# Altium schematic sheet USB_WIFI_PING.SchDoc
size B; DocumentNumber: 1; SheetNumber: 1; SheetTotal: 1
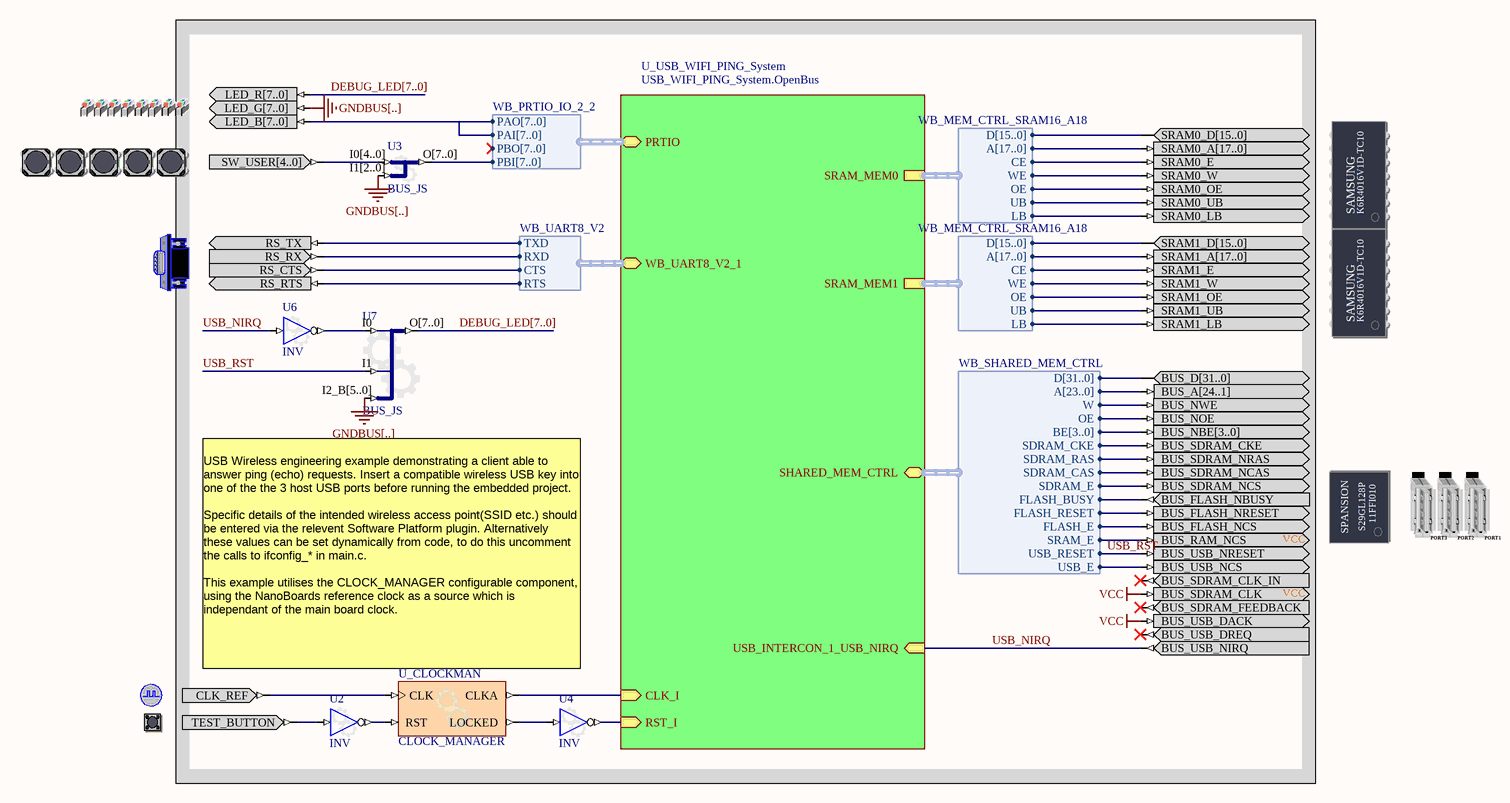
[diagram p0: USB_WIFI_PING.SchDoc]

## Parts
(Parts that share a designator on the sheet are numbered #1, #2 ... from top to bottom, then left to right.)
?#1  LEDS_RGB  (value not drawn)
?#2  SRAM_DAUGHTER0  (value not drawn)
?#3  USER_BUTTONS  (value not drawn)
?#4  SRAM_DAUGHTER1  (value not drawn)
?#5  RS232CNTR  (value not drawn)
?#6  SHARED_FLASH_USB  (value not drawn)
?#7  CLOCK_REFERENCE  (value not drawn)
?#8  TEST_BUTTON  (value not drawn)
U2  INV
U3  BUS_JS
U4  INV
U6  INV
U7  BUS_JS
U_CLOCKMAN  CLOCK_MANAGER

## Sub-sheets
U_USB_WIFI_PING_System = USB_WIFI_PING_System.OpenBus: SRAM_MEM0 (harness WB_MEM_CTRL_SRAM16_A18), SRAM_MEM1 (harness WB_MEM_CTRL_SRAM16_A18), RST_I (in), CLK_I (in), PRTIO (harness WB_PRTIO_IO_2_2), SHARED_MEM_CTRL (harness WB_SHARED_MEM_CTRL), USB_INTERCON_1_USB_NIRQ (in), WB_UART8_V2_1 (harness WB_UART8_V2)

## Harnesses
WB_PRTIO_IO_2_2: PAO[7..0], PAI[7..0], PBO[7..0], PBI[7..0]
WB_MEM_CTRL_SRAM16_A18: D[15..0], A[17..0], CE, WE, OE, UB, LB
WB_SHARED_MEM_CTRL: D[31..0], A[23..0], W, OE, BE[3..0], SDRAM_CKE, SDRAM_RAS, SDRAM_CAS, SDRAM_E, FLASH_BUSY, FLASH_RESET, FLASH_E, SRAM_E, USB_RESET, USB_E
WB_UART8_V2: TXD, RXD, CTS, RTS

## Nets
GNDBUS[..]: ?#1.LED_G[7..0] U3.I1[2..0] U7.I2_B[5..0]
VCC: ?#6.BUS_SDRAM_CLK ?#6.BUS_USB_DACK
DEBUG_LED[7..0]: ?#1.LED_R[7..0] U7.O[7..0]
USB_NIRQ: ?#6.BUS_USB_NIRQ U6.I ; sheet U_USB_WIFI_PING_System/USB_INTERCON_1_USB_NIRQ
USB_RST: ?#6.BUS_USB_NRESET U7.I1 ; sheet U_USB_WIFI_PING_System/SHARED_MEM_CTRL.USB_RESET
Net?#1_LED_B[7..0]: ?#1.LED_B[7..0] ; sheet U_USB_WIFI_PING_System/PRTIO.PAO[7..0], sheet U_USB_WIFI_PING_System/PRTIO.PAI[7..0]
Net?#2_SRAM0_A[17..0]: ?#2.SRAM0_A[17..0] ; sheet U_USB_WIFI_PING_System/SRAM_MEM0.A[17..0]
Net?#2_SRAM0_D[15..0]: ?#2.SRAM0_D[15..0] ; sheet U_USB_WIFI_PING_System/SRAM_MEM0.D[15..0]
Net?#2_SRAM0_E: ?#2.SRAM0_E ; sheet U_USB_WIFI_PING_System/SRAM_MEM0.CE
Net?#2_SRAM0_LB: ?#2.SRAM0_LB ; sheet U_USB_WIFI_PING_System/SRAM_MEM0.LB
Net?#2_SRAM0_OE: ?#2.SRAM0_OE ; sheet U_USB_WIFI_PING_System/SRAM_MEM0.OE
Net?#2_SRAM0_UB: ?#2.SRAM0_UB ; sheet U_USB_WIFI_PING_System/SRAM_MEM0.UB
Net?#2_SRAM0_W: ?#2.SRAM0_W ; sheet U_USB_WIFI_PING_System/SRAM_MEM0.WE
Net?#3_SW_USER[4..0]: ?#3.SW_USER[4..0] U3.I0[4..0]
Net?#4_SRAM1_A[17..0]: ?#4.SRAM1_A[17..0] ; sheet U_USB_WIFI_PING_System/SRAM_MEM1.A[17..0]
Net?#4_SRAM1_D[15..0]: ?#4.SRAM1_D[15..0] ; sheet U_USB_WIFI_PING_System/SRAM_MEM1.D[15..0]
Net?#4_SRAM1_E: ?#4.SRAM1_E ; sheet U_USB_WIFI_PING_System/SRAM_MEM1.CE
Net?#4_SRAM1_LB: ?#4.SRAM1_LB ; sheet U_USB_WIFI_PING_System/SRAM_MEM1.LB
Net?#4_SRAM1_OE: ?#4.SRAM1_OE ; sheet U_USB_WIFI_PING_System/SRAM_MEM1.OE
Net?#4_SRAM1_UB: ?#4.SRAM1_UB ; sheet U_USB_WIFI_PING_System/SRAM_MEM1.UB
Net?#4_SRAM1_W: ?#4.SRAM1_W ; sheet U_USB_WIFI_PING_System/SRAM_MEM1.WE
Net?#5_RS_CTS: ?#5.RS_CTS ; sheet U_USB_WIFI_PING_System/WB_UART8_V2_1.CTS
Net?#5_RS_RTS: ?#5.RS_RTS ; sheet U_USB_WIFI_PING_System/WB_UART8_V2_1.RTS
Net?#5_RS_RX: ?#5.RS_RX ; sheet U_USB_WIFI_PING_System/WB_UART8_V2_1.RXD
Net?#5_RS_TX: ?#5.RS_TX ; sheet U_USB_WIFI_PING_System/WB_UART8_V2_1.TXD
Net?#6_BUS_A[24..1]: ?#6.BUS_A[24..1] ; sheet U_USB_WIFI_PING_System/SHARED_MEM_CTRL.A[23..0]
Net?#6_BUS_D[31..0]: ?#6.BUS_D[31..0] ; sheet U_USB_WIFI_PING_System/SHARED_MEM_CTRL.D[31..0]
Net?#6_BUS_FLASH_NBUSY: ?#6.BUS_FLASH_NBUSY ; sheet U_USB_WIFI_PING_System/SHARED_MEM_CTRL.FLASH_BUSY
Net?#6_BUS_FLASH_NCS: ?#6.BUS_FLASH_NCS ; sheet U_USB_WIFI_PING_System/SHARED_MEM_CTRL.FLASH_E
Net?#6_BUS_FLASH_NRESET: ?#6.BUS_FLASH_NRESET ; sheet U_USB_WIFI_PING_System/SHARED_MEM_CTRL.FLASH_RESET
Net?#6_BUS_NBE[3..0]: ?#6.BUS_NBE[3..0] ; sheet U_USB_WIFI_PING_System/SHARED_MEM_CTRL.BE[3..0]
Net?#6_BUS_NOE: ?#6.BUS_NOE ; sheet U_USB_WIFI_PING_System/SHARED_MEM_CTRL.OE
Net?#6_BUS_NWE: ?#6.BUS_NWE ; sheet U_USB_WIFI_PING_System/SHARED_MEM_CTRL.W
Net?#6_BUS_RAM_NCS: ?#6.BUS_RAM_NCS ; sheet U_USB_WIFI_PING_System/SHARED_MEM_CTRL.SRAM_E
Net?#6_BUS_SDRAM_CKE: ?#6.BUS_SDRAM_CKE ; sheet U_USB_WIFI_PING_System/SHARED_MEM_CTRL.SDRAM_CKE
Net?#6_BUS_SDRAM_NCAS: ?#6.BUS_SDRAM_NCAS ; sheet U_USB_WIFI_PING_System/SHARED_MEM_CTRL.SDRAM_CAS
Net?#6_BUS_SDRAM_NCS: ?#6.BUS_SDRAM_NCS ; sheet U_USB_WIFI_PING_System/SHARED_MEM_CTRL.SDRAM_E
Net?#6_BUS_SDRAM_NRAS: ?#6.BUS_SDRAM_NRAS ; sheet U_USB_WIFI_PING_System/SHARED_MEM_CTRL.SDRAM_RAS
Net?#6_BUS_USB_NCS: ?#6.BUS_USB_NCS ; sheet U_USB_WIFI_PING_System/SHARED_MEM_CTRL.USB_E
Net?#7_CLK_REF: ?#7.CLK_REF U_CLOCKMAN.CLK
Net?#8_TEST_BUTTON: ?#8.TEST_BUTTON U2.I
NetU2_O: U2.O U_CLOCKMAN.RST
NetU3_O[7..0]: U3.O[7..0] ; sheet U_USB_WIFI_PING_System/PRTIO.PBI[7..0]
NetU4_I: U4.I U_CLOCKMAN.LOCKED
NetU4_O: U4.O ; sheet U_USB_WIFI_PING_System/RST_I
NetU6_O: U6.O U7.I0
NetU_CLOCKMAN_CLKA: U_CLOCKMAN.CLKA ; sheet U_USB_WIFI_PING_System/CLK_I

Not connected (* = marked no-connect by the designer): ?#6 BUS_SDRAM_CLK_IN* BUS_SDRAM_FEEDBACK* BUS_USB_DREQ*

## Buses and harness runs
bus DEBUG_LED[7..0]

## Notes on the sheet
- USB Wireless engineering example demonstrating a client able to answer ping (echo) requests. Insert a compatible wireless USB key into one of the the 3 host USB ports before running the embedded project.
  Specific details of the intended wireless access point(SSID etc.) should be entered via the relevent Software Platform plugin. Alternatively these values can be set dynamically from code, to do this uncomment the calls to ifconfig_* in main.c.
  This example utilises the CLOCK_MANAGER configurable component, using the NanoBoards reference clock as a source which is independant of the main board clock.
- Title
- Size:
- Date:
- B
- Number:
- Time:
- Revision:
- Sheet
- of
- File:
- (in symbol SHARED_FLASH_USB) USB2; 11FFI010; SPANSION; S29GL128P; PORT3; PORT2; PORT1; VCC
- (in symbol SRAM_DAUGHTER0) SAMSUNG; K6R4016V1D-TC10
- (in symbol SRAM_DAUGHTER1) SAMSUNG; K6R4016V1D-TC10

## Library data of the parts
?#1 = LEDS_RGB: LEDS RGB; PortComponent: True; Published: 11-Mar-2009; Publisher: Altium Limited; HelpURL: https://wiki.altium.com/display/ADOH/NanoBoard+3000+-+RGB+User+LEDs
?#2 = SRAM_DAUGHTER0: Free Static RAM - Daughterboard; PortComponent: True; Published: 14-May-2007; Publisher: Altium Limited; HelpURL: TR0149 Technical Reference for Altium's Xilinx Spartan-3 Daughter Board DB30.pdf#page=16
?#3 = USER_BUTTONS: Generic User Buttons; PortComponent: True; Published: 16-Apr-2007; Publisher: Altium Limited; HelpURL: TR0143 Technical Reference Manual for Altium's Desktop NanoBoard NB2DSK01.pdf#page=53
?#4 = SRAM_DAUGHTER1: Free Static RAM - Daughterboard; PortComponent: True; Published: 14-May-2007; Publisher: Altium Limited; HelpURL: TR0149 Technical Reference for Altium's Xilinx Spartan-3 Daughter Board DB30.pdf#page=16
?#5 = RS232CNTR: DCE Serial Port Connector; PortComponent: True; Published: 19-Nov-2003; Publisher: Altium Limited; HelpURL: https://wiki.altium.com/display/ADOH/NanoBoard+3000+-+RS-232+Serial+Interface
?#6 = SHARED_FLASH_USB: Common-Bus Flash USB; PortComponent: True; Published: 14-May-2007; Publisher: Altium Limited; HelpURL: TR0149 Technical Reference for Altium's Xilinx Spartan-3 Daughter Board DB30.pdf#page=14
?#7 = CLOCK_REFERENCE: Global System Clock Reference Supply; PortComponent: True; Published: 19-Nov-2003; Publisher: Altium Limited; HelpURL: https://wiki.altium.com/display/ADOH/NanoBoard+3000+-+System+Clocks
?#8 = TEST_BUTTON: Test / Reset Button; PortComponent: True; Published: 19-Nov-2003; Publisher: Altium Limited; HelpURL: TR0143 Technical Reference Manual for Altium's Desktop NanoBoard NB2DSK01.pdf#page=53
U2 U4 = INV: Configurable Inverter; ConfigurationParameters: {}Version[1.1]{}SignalCount[1]{}SignalWidth0[1]{}OutputOption0[Inverted]{}EnableMode[None]{}ShowPinNames[False]{}; ConfiguratorName: GENERIC_BUFFER; LastRevisionNo: 1.00.00; Published: 10-Oct-2008; Publisher: Altium Limited; HelpURL: https://wiki.altium.com/display/ADOH/Configurable+Generic+Library
U3 = BUS_JS: Configurable Bus Joiner/Splitter; ConfiguratorName: GENERIC_BUS_JS; ConfigurationParameters: {}Version[1.0]{}SplitterJoinerType[Joiner]{}SignalCount[2]{}SignalWidth0[5]{}SignalWidth1[3]{}; LastRevisionNo: 1.00.00; Published: 17-Sep-2008; Publisher: Altium Limited
U6 = INV: Configurable Inverter; ConfiguratorName: GENERIC_BUFFER; ConfigurationParameters: {}Version[1.1]{}SignalCount[1]{}SignalWidth0[1]{}OutputOption0[Inverted]{}EnableMode[None]{}ShowPinNames[False]{}; LastRevisionNo: 1.00.00; Published: 19-Sep-2008; Publisher: Altium Limited; HelpURL: https://wiki.altium.com/display/ADOH/Configurable+Generic+Library
U7 = BUS_JS: Configurable Bus Joiner/Splitter; ConfiguratorName: GENERIC_BUS_JS; ConfigurationParameters: {}Version[1.1]{}SplitterJoinerType[Joiner]{}SignalCount[3]{}SignalWidth0[1]{}GapBelow0[3000000]{}ConnectionType0[Pin]{}SignalWidth1[1]{}GapBelow1[2000000]{}ConnectionType1[Pin]{}SignalWidth2[6]{}GapBelow2[2000000]{}ConnectionType2[Pin]{}ShowPinNames[True]{}; LastRevisionNo: 1.00.00; Published: 17-Sep-2008; Publisher: Altium Limited; HelpURL: https://wiki.altium.com/display/ADOH/Configurable+Generic+Library
U_CLOCKMAN = CLOCKMANAGER: Configurable Clock Manager; ConfiguratorName: GENERIC_CLOCKMANAGER; ConfigurationParameters: {}Version[1.0]{}Option_Configuration[object TClockManagerPersist / VersionMajor [ 0 / VersionMinor [ 0 / InputFreq [ 20.000000000000000000 / InputName [ 'CLK' / OutputTargets [ < / item / Name [ 'CLKA' / OutFreqMin [ 40.000000000000000000 / OutFreqMax [ 40.000000000000000000 / OutPostDivider [ 1.000000000000000000 / end> / OutputDevices [ < / item / Name [ 'Spartan3AN' / Valid [ True / OutputActuals [ < / item / Name [ 'CLK0' / Multipler [ 1.000000000000000000 / Divider [ 1.000000000000000000 / OutFreq [ 20.000000000000000000 / OutputMap [ 1 / end / item / Name [ 'CLK90' / Multipler [ 1.000000000000000000 / Divider [ 1.000000000000000000 / OutPhase [ 90.000000000000000000 / OutFreq [ 20.000000000000000000 / OutputMap [ 2 / end / item / Name [ 'CLK180' / Multipler [ 1.000000000000000000 / Divider [ 1.000000000000000000 / OutPhase [ 180.000000000000000000 / OutFreq [ 20.000000000000000000 / OutputMap [ 3 / end / item / Name [ 'CLK270' / Multipler [ 1.000000000000000000 / Divider [ 1.000000000000000000 / OutPhase [ 270.000000000000000000 / OutFreq [ 20.000000000000000000 / OutputMap [ 4 / end / item / Name [ 'CLK2X' / Multipler [ 2.000000000000000000 / Divider [ 1.000000000000000000 / OutFreq [ 40.000000000000000000 / OutputMap [ 0 / end / item / Name [ 'CLKDV' / Multipler [ 1.000000000000000000 / Divider [ 2.000000000000000000 / OutFreq [ 10.000000000000000000 / OutputMap [ 5 / end / item / Name [ 'CLK2X180' / Multipler [ 1.000000000000000000 / Divider [ 1.000000000000000000 / OutPhase [ 180.000000000000000000 / OutFreq [ 40.000000000000000000 / OutputMap [ 6 / end / item / Name [ 'CLKFX' / Multipler [ 2.000000000000000000 / Divider [ 1.000000000000000000 / OutFreq [ 40.000000000000000000 / OutputMap [ 7 / end / item / Name [ 'CLKFX180' / Multipler [ 1.000000000000000000 / Divider [ 1.000000000000000000 / OutPhase [ 180.000000000000000000 / OutFreq [ 40.000000000000000000 / OutputMap [ 8 / end> / InternalActuals [ <> / CustomVars [ <> / end> / MinInputFreq [ 1.000000000000000000 / MaxInputFreq [ 280.000000000000000000 / MinOutputFreq [ 18.000000000000000000 / MaxOutputFreq [ 210.000000000000000000 / MaxOutputCount [ 9 / end]{}; LastRevisionNo: 1.00.00; Published: 18-Feb-2009; Publisher: Altium Limited; HelpURL: https://wiki.altium.com/display/ADOH/New+Configurable+Generic+FPGA+Logic+Components